# Altium schematic sheet Supply_12V.SchDoc
size Letter
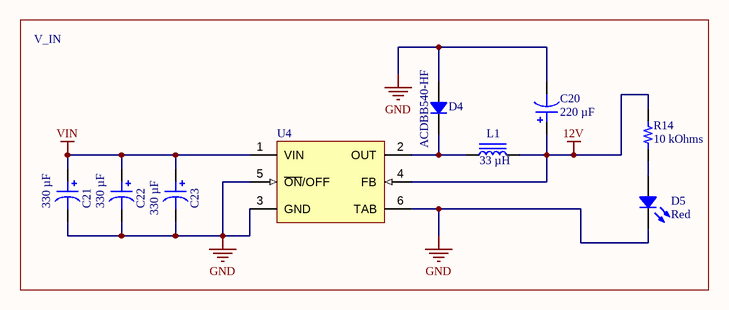
[diagram p0: Supply_12V.SchDoc]

## Parts
C20  220 µF  [CAP ALSMD 8.3MM H10.5MM]
C21  330 µF  [CAP ALSMD 8.3MM H10.5MM]
C22  330 µF  [CAP ALSMD 8.3MM H10.5MM]
C23  330 µF  [CAP ALSMD 8.3MM H10.5MM]
D4  ACDBB540-HF  [DO214AA SMB]
D5  Red  [LED 0603_1608 RED]
L1  33 µH  [BOURNS SRR1280]
R14  10 kOhms  [YAGEO RES 0603_1608]
U4  (no value)  [KTT0005B_M]

## Blocks framed on the sheet
V_IN: C20-C23 D4 D5 L1 R14 U4

## Nets
12V: C20.1 L1.2 R14.2 U4.4(FB)
GND: C20.2 C21.2 C22.2 C23.2 D4.1 D5.2 U4.3(GND) U4.5(~{ON}/OFF) U4.6(TAB)
VIN: C21.1 C22.1 C23.1 U4.1(VIN)
NetD4_2: D4.2 L1.1 U4.2(OUT)
NetD5_1: D5.1 R14.1

## Notes on the sheet
- DWG. NO.
- REV.
- SHT.
- REVISION
- DESCRIPTION
- DATE
- APPROVED
- THIS DOCUMENT AND THE DATA DISCLOSED HEREIN OR HEREWITH IS THE PROPERTY OF ALTIUM LIMITED AND MAY BE FREELY DISTRIBUTED IN WHOLE. NO RIGHTS ARE RESERVED OR EXPRESS OR IMPLIED WARANTEE GIVEN.
- ENG:
- DSN:
- APPROVALS
- PROJECT
- DOCUMENT REVISION:
- DESIGN ITEM:
- CHK:
- BOM:
- REFERENCE DOCUMENTS
- PROJECT REVISION:
- TITLE
- FAB DWG:
- PCB DWG:
- ASSY DWG:
- SCALE:
- SIZE
- C
- CAGE CODE
- FILE NAME
- DWG NO.
- SHEET
- OF
- REV

## Library data of the parts
C20 = 25SKV220M8X10.5: CAP ALUM 220UF 20% 25V SMD; manufacturer: Rubycon; Lifetime @ Temp.: 1000 Hrs @ 105°C; Polarization: Polar; Ripple Current @ High Frequency: 228 mA @ 10 kHz; Ripple Current @ Low Frequency: 190 mA @ 120 Hz; Surface Mount Land Size: 0.327" L x 0.327" W (8.30mm x 8.30mm); componentlink2url: https://www.digikey.com/en/products/detail/rubycon/25SKV220M8X10-5/3568724; componentlink1description: Datasheet; componentlink1url: http://www.rubycon.co.jp/en/catalog/e_pdfs/aluminum/e_SKV.pdf; componentlink2description: DigiKey Link; packaging: TapeAndReel; Part Number: 25SKV220M8X10.5; Applications: General Purpose; Capacitance: 220 µF; Device Package: Radial, Can - SMD; Height - Seated (Max): 0.413" (10.50mm); lastupdated: 2024-06-03 20:15:46; Lifecycle Status: Active; Minimum Order: 1; Mounting Type: Surface Mount; Operating Temperature: -55°C ~ 105°C; Package / Case: Radial, Can - SMD; partid: 7651; Part Status: Active; price: 0.12; series: SKV; Size / Dimension: 0.315" Dia (8.00mm); Supplier 1: DigiKey; Supplier Part Number 1: 1189-3082-1-ND; Tolerance: ±20%; value: 220 µF; Voltage - Rated: 25 V
C21-C23 = EMZS350ARA331MHA0G: CAP ALUM 330UF 20% 35V SMD; manufacturer: United Chemi-Con; ESR (Equivalent Series Resistance): 80mOhm @ 100kHz; Lifetime @ Temp.: 2000 Hrs @ 105°C; Polarization: Polar; Ripple Current @ High Frequency: 850 mA @ 100 kHz; Ripple Current @ Low Frequency: 425 mA @ 120 Hz; Surface Mount Land Size: 0.327" L x 0.327" W (8.30mm x 8.30mm); Part Number: EMZS350ARA331MHA0G; Applications: Automotive; Capacitance: 330 µF; componentlink1description: Datasheet; componentlink1url: //media.digikey.com/pdf/Data%20Sheets/United%20Chemi-Con%20PDFs/MZS_Series_NPI.pdf; componentlink2description: DigiKey Link; componentlink2url: https://www.digikey.com/en/products/detail/united-chemi-con/EMZS350ARA331MHA0G/8637077; Device Package: Radial, Can - SMD; Height - Seated (Max): 0.413" (10.50mm); lastupdated: 2024-06-03 20:15:47; Lifecycle Status: Active; Minimum Order: 1; Mounting Type: Surface Mount; Operating Temperature: -55°C ~ 105°C; Package / Case: Radial, Can - SMD; packaging: TapeAndReel; partid: 7592; Part Status: Active; price: 0.30; Ratings: AEC-Q200; series: Alchip™- MZS; Size / Dimension: 0.315" Dia (8.00mm); Supplier 1: DigiKey; Supplier Part Number 1: 565-5121-1-ND; Tolerance: ±20%; value: 330 µF; Voltage - Rated: 35 V
D4 = ACDBB540-HF: DIODE SCHOTTKY 40V 5A DO214AA; Manufacturer: Comchip Technology; Capacitance @ Vr, F: 300pF @ 4V, 1MHz; Current - Reverse Leakage @ Vr: 500 µA @ 40 V; Speed: Fast Recovery =< 500ns, > 200mA (Io); Voltage - Forward (Vf) (Max) @ If: 550 mV @ 5 A; Part Number: ACDBB540-HF; ComponentLink1Description: Datasheet; ComponentLink1URL: http://www.comchiptech.com/admin/files/product/ACDBB540-HF%20RevA196617.pdf; ComponentLink2Description: DigiKey Link; ComponentLink2URL: https://www.digikey.com/en/products/detail/comchip-technology/ACDBB540-HF/7100744; Current - Average Rectified (Io): 5A; Diode Type: Schottky; LastUpdated: 2024-06-03 19:54:00; Lifecycle Status: Active; Minimum Order: 1; Mounting Type: Surface Mount; Operating Temperature - Junction: -55°C ~ 125°C; Package / Case: DO-214AA, SMB; Packaging: TapeAndReel; PartId: 1496; Part Status: Active; Price: 0.18; Series: -; Supplier 1: DigiKey; Supplier Part Number 1: 641-1898-1-ND; Supplier Device Package: DO-214AA (SMB); Voltage - DC Reverse (Vr) (Max): 40 V
D5 = LR Q976.01-P2R2-1: LED RED CLEAR 0603 SMD; Manufacturer: ams-OSRAM USA Inc.; Current - Test: 20mA; Lens Color: Colorless; Lens Size: 1.10mm x 0.80mm; Lens Style: Rectangle with Flat Top; Millicandela Rating: 118mcd; Viewing Angle: 140°; Voltage - Forward (Vf) (Typ): 2V; Wavelength - Dominant: 623nm; Wavelength - Peak: 628nm; Part Number: LR Q976.01-P2R2-1; Color: Red; ComponentLink2Description: DigiKey Link; ComponentLink2URL: https://www.digikey.com/en/products/detail/ams-osram-usa-inc/LR-Q976-01-P2R2-1/21556490; Device Package: 0603 (1608 Metric); Height (Max): 0.75mm; LastUpdated: 2024-06-03 19:59:37; Lens Transparency: Clear; Lifecycle Status: Active; Minimum Order: 1; Mounting Type: Surface Mount; Package / Case: 0603 (1608 Metric); Packaging: TapeAndReel; PartId: 1467; Price: 0.02; Series: LO Q976.01; Size / Dimension: 1.60mm L x 0.80mm W; Supplier 1: DigiKey; Supplier Part Number 1: 475-LRQ976.01-P2R2-1CT-ND; Supplier Device Package: 0603; Value: Red
L1 = SRR1280-330M: FIXED IND 33UH 3.5A 57 MOHM SMD; Manufacturer: Bourns Inc.; Shielding: Shielded; Tolerance: ±20%; DC Resistance (DCR): 57mOhm Max; Current - Saturation: 3.3A; Frequency - Self Resonant: 9.5MHz; Inductance Frequency - Test: 100 kHz; Material - Core: Ferrite; Q @ Freq: 28 @ 2.52MHz; Type: Drum Core, Wirewound; Series: SRR1280; Height - Seated (Max): 0.315" (8.00mm); Inductance: 33 µH; Packaging: TapeAndReel; Part Number: SRR1280-330M; ComponentLink1Description: Datasheet; ComponentLink1URL: https://www.bourns.com/docs/Product-Datasheets/SRR1280.pdf; ComponentLink2Description: DigiKey Link; ComponentLink2URL: https://www.digikey.com/en/products/detail/bourns-inc/SRR1280-330M/1969998; Current Rating (Amps): 3.5 A; Device Package: Nonstandard; LastUpdated: 2024-11-25 00:45:31; Lifecycle Status: Active; Minimum Order: 1; Mounting Type: Surface Mount; Operating Temperature: -40°C ~ 125°C; Package / Case: Nonstandard; PartId: 25; Part Status: Active; Price: 0.45; Size / Dimension: 0.492" L x 0.492" W (12.50mm x 12.50mm); Supplier 1: DigiKey; Supplier Part Number 1: SRR1280-330MCT-ND; Value: 33 µH
R14 = AC0603JR-0710KL: RES SMD 10K OHM 5% 1/10W 0603; Manufacturer: Yageo; Power (Watts): 0.1W, 1/10W; Temperature Coefficient: ±100ppm/°C; Part Number: AC0603JR-0710KL; Value: 10 kOhms; ComponentLink1Description: Datasheet; ComponentLink1URL: https://www.yageo.com/upload/media/product/productsearch/datasheet/rchip/PYu-AC_51_RoHS_L_7.pdf; ComponentLink2Description: DigiKey Link; ComponentLink2URL: https://www.digikey.com/en/products/detail/yageo/AC0603JR-0710KL/2827830; Composition: Thick Film; Device Package: 0603 (1608 Metric); Features: Automotive AEC-Q200, Moisture Resistant; Height - Seated (Max): 0.022" (0.55mm); LastUpdated: 2024-07-25 09:19:28; Lifecycle Status: Active; Minimum Order: 1; Number of Terminations: 2; Operating Temperature: -55°C ~ 155°C; Package / Case: 0603 (1608 Metric); Packaging: CutTape; PartId: 12247; Part Status: Active; Price: 0.01; Ratings: AEC-Q200; Resistance: 10 kOhms; Series: AC; Size / Dimension: 0.063" L x 0.031" W (1.60mm x 0.80mm); Supplier 1: DigiKey; Supplier Part Number 1: 311-10KLECT-ND; Supplier Device Package: 0603; Tolerance: ±5%
U4 = LM2576S-12/NOPB: SIMPLE SWITCHER® 3A Step-Down Voltage Regulator, 5-pin TO-263, Pb-Free; Manufacturer: Texas Instruments; PackageTopMarking: NSUZXYTTE#*LM2576S*-12 P+; PowerWise: N; ComponentLink1Description: Datasheet URL; PinCount: 5; ComponentLink1URL: http://www.ti.com/general/docs/lit/getliterature.tsp?genericPartNumber=LM2576&fileType=pdf; Code_JEDEC: MO-169-AB; PackageReference: KTT0005B; PackageDescription: TO-263, Molded, .400 x .390 x .180in, 5 Lead, .067in Pitch, Surface Mount; CompType: Switcher; RoHS: Y